# Altium schematic sheet Display.SchDoc: Smart Bus Ticketing Machine/Outputs/Display
size A; ApprovedBy: Kiran Gunathilaka; CheckedBy: Kiran Gunathilaka; Author: Kiran Gunathilaka; DrawnBy: Kiran Gunathilaka; Engineer: Kiran Gunathilaka; DocumentNumber: 11; Revision: v1.2; SheetNumber: 11; SheetTotal: 11
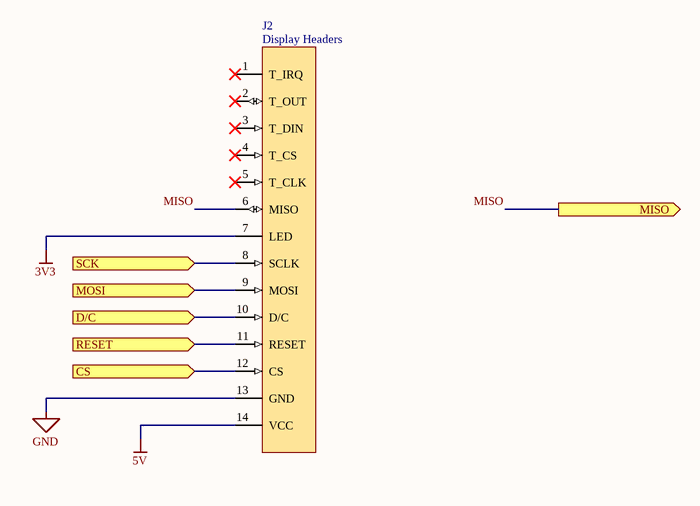
[diagram p0: Display.SchDoc]

## Parts
J2  Display Headers  [Display Without Cutouts]

## Ports
CS (in, see Outputs[3C], MCU[4A], Outputs[2C]), D/C (in, see Outputs[3D], MCU[4A], Outputs[2D]), MISO (out, see Outputs[3C], MCU[1A], Outputs[4C]), MOSI (in, see Outputs[3D], MCU[4A], Outputs[2D]), RESET (in, see Outputs[3D], MCU[4A], Outputs[2D]), SCK (in, see Outputs[3C], MCU[4A], Outputs[2C])

## Nets
3V3: J2.7(LED)
5V: J2.14(VCC)
GND: J2.13(GND)
CS: J2.12(CS) ; port CS
D/C: J2.10(D/C) ; port D/C
MISO: J2.6(MISO) ; port MISO
MOSI: J2.9(MOSI) ; port MOSI
RESET: J2.11(RESET) ; port RESET
SCK: J2.8(SCLK) ; port SCK

Not connected (* = marked no-connect by the designer): J2 1(T_IRQ)* 2(T_OUT)* 3(T_DIN)* 4(T_CS)* 5(T_CLK)*

## Library data of the parts
J2 = TFT-LCD-2.8'' Display Headers